# Altium project Status_Light_PCB.PrjPcb
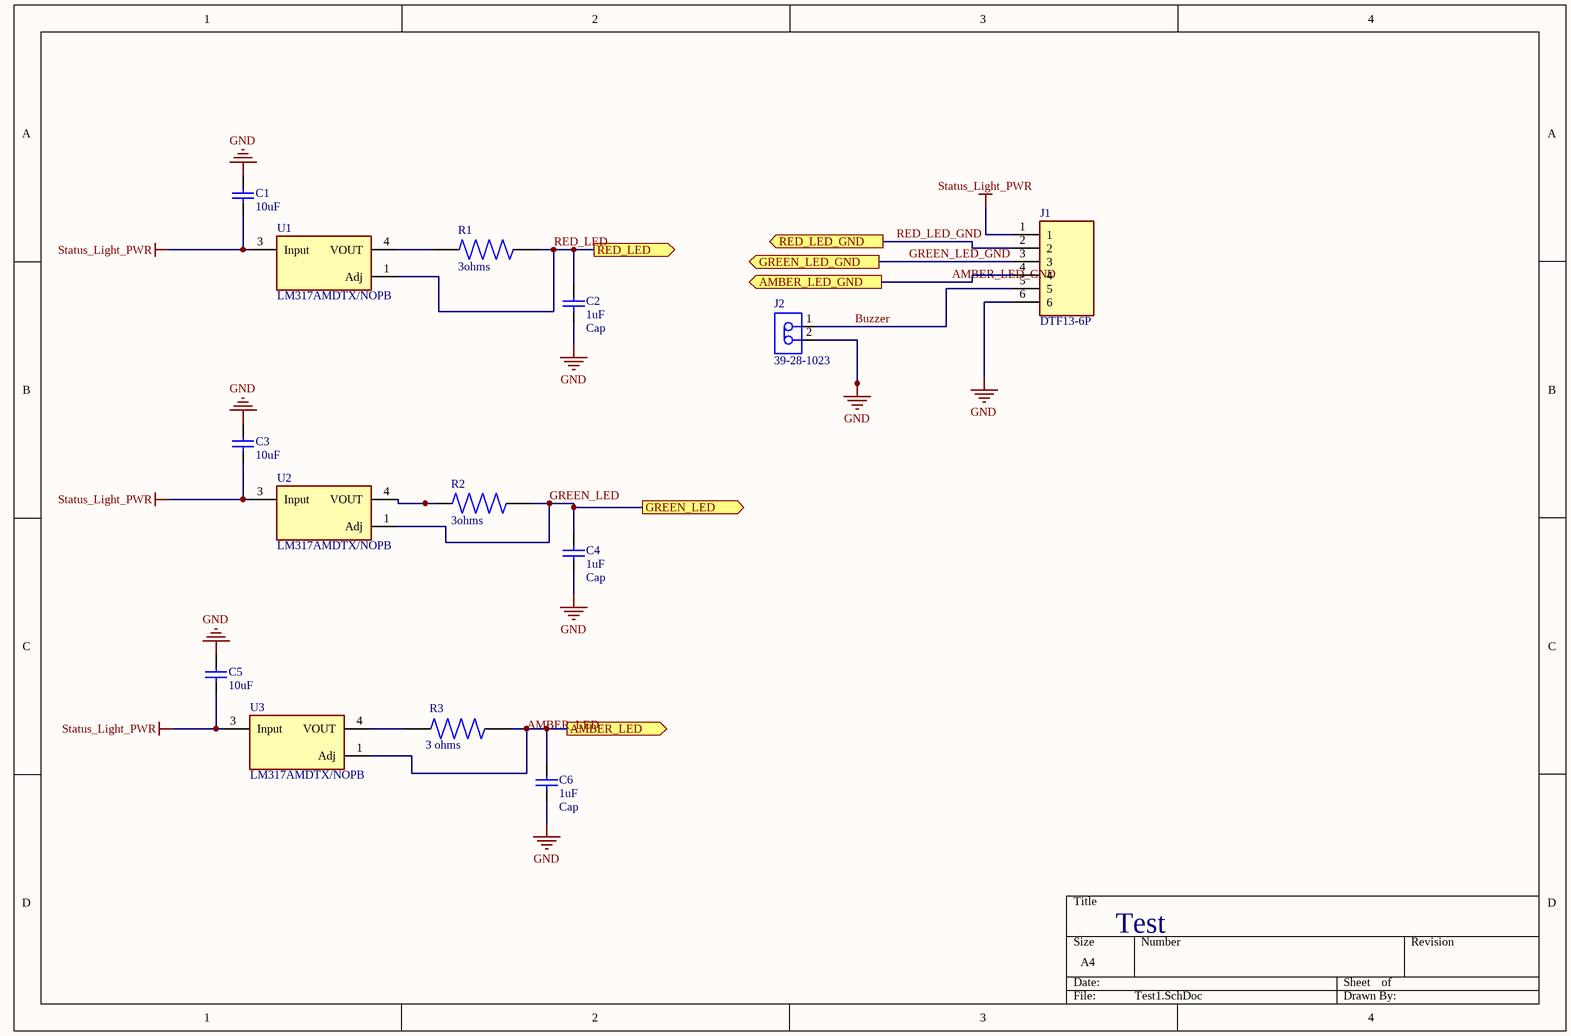
[diagram p0: Test1.SchDoc]
1 sheet, 14 parts. Net scope: flat (ports and power ports of the same name join across sheets).
Board file: PCB1.PcbDoc

## Sheet Test1.SchDoc
size A4; SheetNumber: 1; SheetTotal: 1

### Parts
C1  C2: 10uF  [1608[0603]]  (hidden comment: Cap)
C2  Cap  C2: 1uF  [1608[0603]]
C3  C2: 10uF  [1608[0603]]  (hidden comment: Cap)
C4  Cap  C2: 1uF  [1608[0603]]
C5  C2: 10uF  [1608[0603]]  (hidden comment: Cap)
C6  Cap  C2: 1uF  [1608[0603]]
J1  DTF13-6P  [TE_DTF13-6P]
J2  39-28-1023  [MOLX-39-28-1023-2_V]
R1  3ohms  [RESC3216X70N]
R2  3ohms  [RESC3216X70N]
R3  3 ohms  [RESC3216X70N]
U1  LM317AMDTX/NOPB  [FP-NDP0003B-MFG]
U2  LM317AMDTX/NOPB  [FP-NDP0003B-MFG]
U3  LM317AMDTX/NOPB  [FP-NDP0003B-MFG]

### Ports
AMBER_LED (out), AMBER_LED_GND (out), GREEN_LED (out), GREEN_LED_GND (out), RED_LED (out), RED_LED_GND (out)

### Nets
GND: C1.2 C2.1 C3.2 C4.1 C5.2 C6.1 J1.6 J2.2
Status_Light_PWR: C1.1 C3.1 C5.1 J1.1 U1.3(Input) U2.3(Input) U3.3(Input)
AMBER_LED: C6.2 R3.2 U3.1(Adj) ; port AMBER_LED
AMBER_LED_GND: J1.4 ; port AMBER_LED_GND
Buzzer: J1.5 J2.1
GREEN_LED: C4.2 R2.2 U2.1(Adj) ; port GREEN_LED
GREEN_LED_GND: J1.3 ; port GREEN_LED_GND
RED_LED: C2.2 R1.2 U1.1(Adj) ; port RED_LED
RED_LED_GND: J1.2 ; port RED_LED_GND
NetR1_1: R1.1 U1.4(VOUT)
NetR2_1: R2.1 U2.4(VOUT)
NetR3_1: R3.1 U3.4(VOUT)

### Notes on the sheet
- Test

### Library data of the parts
C1-C6 = Cap: Capacitor; Published: 8-Jun-2000; LatestRevisionDate: 17-Jul-2002; LatestRevisionNote: Re-released for DXP Platform.; PackageReference: RAD-0.3; Publisher: Altium Limited; PackageDescription: Radial Cap, Thru-Hole; 2 Leads; 0.3 in Pin Spacing
  C1 C3 C5: Supplier 1: Mouser; Supplier Part Number 1: 81-GRM188R61E106MA3D
  C2 C6: Supplier 1: Digikey; Supplier Part Number 1: 445-5956-1-ND
  C4: Supplier 1: DigiKey; Supplier Part Number 1: 445-5956-1-ND
J1 = DTF13-6P: Conn Wire to Board RCP 6 POS 4.45mm Solder RA Thru-Hole Automotive Package; MF: TE Connectivity; Package: None; Price: None; Check_prices: https://www.snapeda.com/parts/DTF13-6P/TE+Connectivity+Deutsch+Connectors/view-part/?ref=eda; Value: *; SnapEDA_Link: https://www.snapeda.com/parts/DTF13-6P/TE+Connectivity+Deutsch+Connectors/view-part/?ref=snap; MP: DTF13-6P; EU_RoHS_Compliance: Compliant with Exemptions; Availability: In Stock; Purchase-URL: https://pricing.snapeda.com/search?q=DTF13-6P&ref=eda
J2 = CMP-2000-05244-1: Female Header, Pitch 4.2 mm, 1 x 2 Position, Height 12.8 mm, Tail Length 3.5 mm, -40 to 105 degC, RoHS; Manufacturer: Molex; No. of Poles: 2; Working Voltage: 250V; No. of Rows: 1; Current Rating: 13A; Contact Termination: Solder; No. of Contacts: 4; Connector Body Material: –; Voltage Rating V AC: 600V; Mounting Orientation: Straight; Pitch Spacing: 4.2mm; Connector Mounting: PCB; Connector Type: RectangularPower; Manufacturer URL: http://www.molex.com/; Contact Plating: Tin; Gender: Header; Lead Spacing: 4.2mm; Colour: Clear; Series: Mini-FitJr; No. of Ways: 2; MSL: –; Connector Insert Type: Header; Flammability Rating: UL94V-2; Datasheet URL: https://datasheet.ciiva.com/11746/0900766b80460d9e-11746456.pdf; Termination Method: Solder; Mounting Type: PCBoard; Contact Material: Brass; Datasheet Version: Rev. F, 05/2004; SVHC: –; Connector Mounting Orientation: PCB; Contact Gender: –
R1-R3 = RMCF1206FT3R00: Package: None; Price: None; Value: *; MP: RMCF1206FT3R00; Availability: Unavailable
  R1: Supplier 1: Future Electronics; Supplier Part Number 1: 6445357
U1-U3 = CMP-04917-000060-1: IC REG LIN POS ADJ 1.5A TO252-3; Manufacturer: Texas Instruments; Min Supply Voltage: 4.2V; Number Of Outputs: 1; Accuracy Percentage: 1%; Nominal Supply Current: 50uA; Output Voltage: 1.25-37V; Output Type: AdjustableProgrammable; Standoff Height: 0.17mm; Max Supply Voltage: 40V; Manufacturer Part Number: LM317AMDTX/NOPB; ComponentLink2URL: http://www.ti.com/lit/ds/symlink/lm317a.pdf; Height: 2.72mm; Device Class L2: Power Management ICs; Device Class L3: Voltage Regulators - Linear; Category: IC; Octopart: https://octopart.com/lm317amdtx%2Fnopb-texas+instruments-24813637; Automotive: No; Lead Free: Yes; RoHS: TRUE; Temperature Range Low: -40°C; Device Class L1: Integrated Circuits (ICs); Digikey Description: IC REG LIN POS ADJ 1.5A TO252-3; Temperature: -40°C to +125°C; ComponentLink2Description: Datasheet; Temperature Range High: +125°C; Package: NDP0003B; Output Current: 1.5A